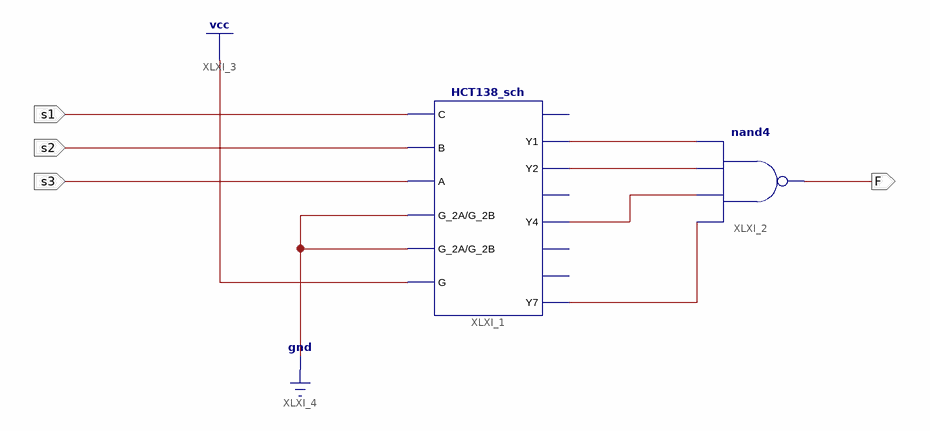
[diagram p0: schematic sheet 1]
// Xilinx ISE schematic Lamp138.sch (kintex7) as structural Verilog: 2 symbols, 4 ports
module Lamp138 (
  input  s1,
  input  s2,
  input  s3,
  output F
);

  wire XLXN_9, XLXN_10, XLXN_11, XLXN_12;

  HCT138_sch XLXI_1 (
    .C(s1), .B(s2), .A(s3), .G_2A(1'b0), .G_2B(1'b0), .G(1'b1), .Y1(XLXN_9), .Y2(XLXN_10), .Y4(XLXN_11),
    .Y7(XLXN_12));  // open: Y0, Y3, Y5, Y6
  nand XLXI_2 (F, XLXN_12, XLXN_11, XLXN_10, XLXN_9);
endmodule
